# EAGLE schematic main_board (EAGLE 8.5.2)
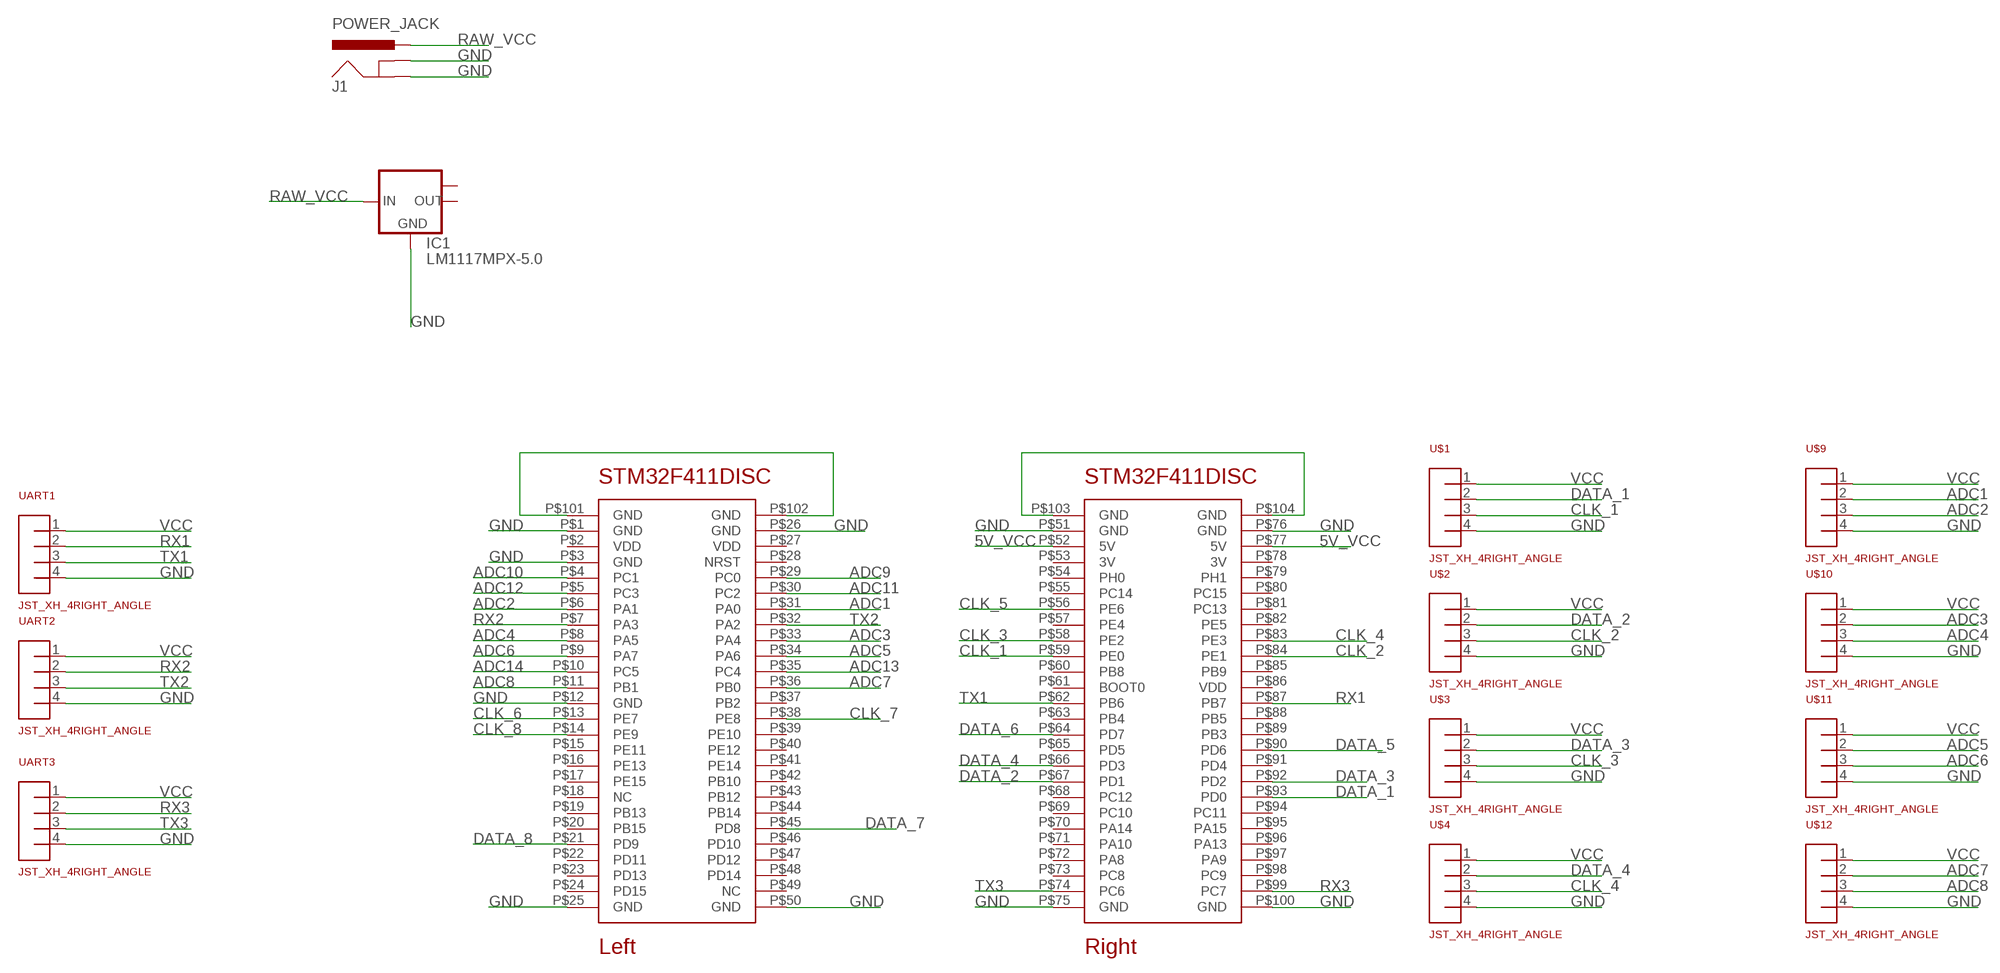
[diagram p0: schematic, sheet 1]

## Parts
IC1  LM1117MPX-5.0  [SOT223]
J1  POWER_JACK  [POWER_JACK_PTH]
STM32F411DISC  STM32F411_DISCOVERY  [STM32F411_DISCOVERY]
U$1  JST_XH_4RIGHT_ANGLE  [JST_XH_4PIN_RIGHT_ANGLE]
U$2  JST_XH_4RIGHT_ANGLE  [JST_XH_4PIN_RIGHT_ANGLE]
U$3  JST_XH_4RIGHT_ANGLE  [JST_XH_4PIN_RIGHT_ANGLE]
U$4  JST_XH_4RIGHT_ANGLE  [JST_XH_4PIN_RIGHT_ANGLE]
U$9  JST_XH_4RIGHT_ANGLE  [JST_XH_4PIN_RIGHT_ANGLE]
U$10  JST_XH_4RIGHT_ANGLE  [JST_XH_4PIN_RIGHT_ANGLE]
U$11  JST_XH_4RIGHT_ANGLE  [JST_XH_4PIN_RIGHT_ANGLE]
U$12  JST_XH_4RIGHT_ANGLE  [JST_XH_4PIN_RIGHT_ANGLE]
UART1  JST_XH_4RIGHT_ANGLE  [JST_XH_4PIN_RIGHT_ANGLE]
UART2  JST_XH_4RIGHT_ANGLE  [JST_XH_4PIN_RIGHT_ANGLE]
UART3  JST_XH_4RIGHT_ANGLE  [JST_XH_4PIN_RIGHT_ANGLE]

## Nets
5V_VCC: STM32F411DISC.P$52(5V) STM32F411DISC.P$77(5V)
ADC1: STM32F411DISC.P$31(PA0) U$9.2
ADC2: STM32F411DISC.P$6(PA1) U$9.3
ADC3: STM32F411DISC.P$33(PA4) U$10.2
ADC4: STM32F411DISC.P$8(PA5) U$10.3
ADC5: STM32F411DISC.P$34(PA6) U$11.2
ADC6: STM32F411DISC.P$9(PA7) U$11.3
ADC7: STM32F411DISC.P$36(PB0) U$12.2
ADC8: STM32F411DISC.P$11(PB1) U$12.3
ADC9: STM32F411DISC.P$29(PC0)
ADC10: STM32F411DISC.P$4(PC1)
ADC11: STM32F411DISC.P$30(PC2)
ADC12: STM32F411DISC.P$5(PC3)
ADC13: STM32F411DISC.P$35(PC4)
ADC14: STM32F411DISC.P$10(PC5)
CLK_1: STM32F411DISC.P$59(PE0) U$1.3
CLK_2: STM32F411DISC.P$84(PE1) U$2.3
CLK_3: STM32F411DISC.P$58(PE2) U$3.3
CLK_4: STM32F411DISC.P$83(PE3) U$4.3
CLK_5: STM32F411DISC.P$56(PE6)
CLK_6: STM32F411DISC.P$13(PE7)
CLK_7: STM32F411DISC.P$38(PE8)
CLK_8: STM32F411DISC.P$14(PE9)
DATA_1: STM32F411DISC.P$93(PD0) U$1.2
DATA_2: STM32F411DISC.P$67(PD1) U$2.2
DATA_3: STM32F411DISC.P$92(PD2) U$3.2
DATA_4: STM32F411DISC.P$66(PD3) U$4.2
DATA_5: STM32F411DISC.P$90(PD6)
DATA_6: STM32F411DISC.P$64(PD7)
DATA_7: STM32F411DISC.P$45(PD8)
DATA_8: STM32F411DISC.P$21(PD9)
GND: IC1.1(GND) J1.GND J1.GNDBREAK STM32F411DISC.P$1(GND) STM32F411DISC.P$3(GND) STM32F411DISC.P$12(GND) STM32F411DISC.P$25(GND) STM32F411DISC.P$26(GND) STM32F411DISC.P$50(GND) STM32F411DISC.P$51(GND) STM32F411DISC.P$75(GND) STM32F411DISC.P$76(GND) STM32F411DISC.P$100(GND) U$1.4 U$2.4 U$3.4 U$4.4 U$9.4 U$10.4 U$11.4 U$12.4 UART1.4 UART2.4 UART3.4
N$1: STM32F411DISC.P$103(GND) STM32F411DISC.P$104(GND)
N$14: STM32F411DISC.P$101(GND) STM32F411DISC.P$102(GND)
RAW_VCC: IC1.3(IN) J1.PWR
RX1: STM32F411DISC.P$87(PB7) UART1.2
RX2: STM32F411DISC.P$7(PA3) UART2.2
RX3: STM32F411DISC.P$99(PC7) UART3.2
TX1: STM32F411DISC.P$62(PB6) UART1.3
TX2: STM32F411DISC.P$32(PA2) UART2.3
TX3: STM32F411DISC.P$74(PC6) UART3.3
VCC: U$1.1 U$2.1 U$3.1 U$4.1 U$9.1 U$10.1 U$11.1 U$12.1 UART1.1 UART2.1 UART3.1
Unconnected: IC1.2(OUT) IC1.TAB(OUT1) STM32F411DISC.P$2(VDD) STM32F411DISC.P$15(PE11) STM32F411DISC.P$16(PE13) STM32F411DISC.P$17(PE15) STM32F411DISC.P$18(NC) STM32F411DISC.P$19(PB13) STM32F411DISC.P$20(PB15) STM32F411DISC.P$22(PD11) STM32F411DISC.P$23(PD13) STM32F411DISC.P$24(PD15) STM32F411DISC.P$27(VDD) STM32F411DISC.P$28(NRST) STM32F411DISC.P$37(PB2) STM32F411DISC.P$39(PE10) STM32F411DISC.P$40(PE12) STM32F411DISC.P$41(PE14) STM32F411DISC.P$42(PB10) STM32F411DISC.P$43(PB12) STM32F411DISC.P$44(PB14) STM32F411DISC.P$46(PD10) STM32F411DISC.P$47(PD12) STM32F411DISC.P$48(PD14) STM32F411DISC.P$49(NC) STM32F411DISC.P$53(3V) STM32F411DISC.P$54(PH0) STM32F411DISC.P$55(PC14) STM32F411DISC.P$57(PE4) STM32F411DISC.P$60(PB8) STM32F411DISC.P$61(BOOT0) STM32F411DISC.P$63(PB4) STM32F411DISC.P$65(PD5) STM32F411DISC.P$68(PC12) STM32F411DISC.P$69(PC10) STM32F411DISC.P$70(PA14) STM32F411DISC.P$71(PA10) STM32F411DISC.P$72(PA8) STM32F411DISC.P$73(PC8) STM32F411DISC.P$78(3V) STM32F411DISC.P$79(PH1) STM32F411DISC.P$80(PC15) STM32F411DISC.P$81(PC13) STM32F411DISC.P$82(PE5) STM32F411DISC.P$85(PB9) STM32F411DISC.P$86(VDD) STM32F411DISC.P$88(PB5) STM32F411DISC.P$89(PB3) STM32F411DISC.P$91(PD4) STM32F411DISC.P$94(PC11) STM32F411DISC.P$95(PA15) STM32F411DISC.P$96(PA13) STM32F411DISC.P$97(PA9) STM32F411DISC.P$98(PC9)

## Library data of the parts
IC1 = lm1117:LM1117MPX-*
J1 = SparkFun-Connectors:POWER_JACK: Power Jack Connector This is the standard 5.5mm barrel jack for power. The PTH is the most common, proven, reliable, footprint. The Slot footprint only works if the mill layer is transmitted to the PCB fab house so be warned. Here are the connectors we sell at SparkFun: DC Barrel Power Jack/Connector <https://www.sparkfun.com/products/119> (PRT-00119) DC Barrel Power Jack/Connector (SMD) <https://www.sparkfun.com/products/12748> (PRT-12748) DC Barrel Jack Adapter - Breadboard Compatible <https://www.sparkfun.com/products/10811> (PRT-10811) It is used on this SparkFun product (and many, many others): SparkFun RedBoard - Programmed with Arduino <https://www.sparkfun.com/products/12757> (DEV-12757) Also, if you need a mating power supply or connector, please check these out: Wall Adapter Power Supply - 9VDC 650mA <https://www.sparkfun.com/products/298> (TOL-00298) DC Barrel Jack Adapter - Male <https://www.sparkfun.com/products/10287> (PRT-10287); PROD_ID: CONN-08197
STM32F411DISC = STM32F411_DISCOVERY:STM32F411_DISCOVERY: The Discovery kit for STM32F411 line helps you to discover the entry level microcontrollers of the STM32 F4 series and to develop your applications easily. It offers everything required for beginners and experienced users to get started quickly. Based on the STM32F411VET6, it includes an ST-LINK/V2 embedded debug tool, a gyroscope, an e-compass and digital microphone ST MEMs, an audio DAC with an integrated class D speaker driver, an OTG micro-AB connector, LEDs and push-buttons. Key Features STM32F411VET6 microcontroller featuring 512 KB of Flash memory, 128 KB of RAM in an LQFP100 package On-board ST-LINK/V2 with selection mode switch to use the kit as a standalone ST-LINK/V2 (with SWD connector for programming and debugging) Board power supply: through USB bus or from an external 5 V supply voltage External application power supply: 3 V and 5 V L3GD20: ST MEMS motion sensor 3-axis digital output gyroscope LSM303DLHC: ST MEMS system-in-package featuring a 3D digital linear acceleration sensor and a 3D digital magnetic sensor MP45DT02: ST MEMS audio sensor, omnidirectional digital microphone CS43L22, audio DAC with integrated class D speaker driver Eight LEDs: LD1 (red/green) for USB communication LD2 (red) for 3.3 V power on Four user LEDs: LD3 (orange), LD4 (green), LD5 (red) and LD6 (blue) Two USB OTG LEDs: LD7 (green) VBus and LD8 (red) over-current Two push-buttons (user and reset) USB OTG with micro-AB connector Extension header for LQFP100 I/Os for a quick connection to the prototyping board and an easy probing Comprehensive free software including a variety of examples, part of STM32CubeF4 package or STSW-STM32136 for legacy Standard Libraries usage
U$1-U$4 U$9-U$12 UART1-UART3 = parts:JST_XH_4